# EAGLE design FidoBark11 (EAGLE 7.2.0)
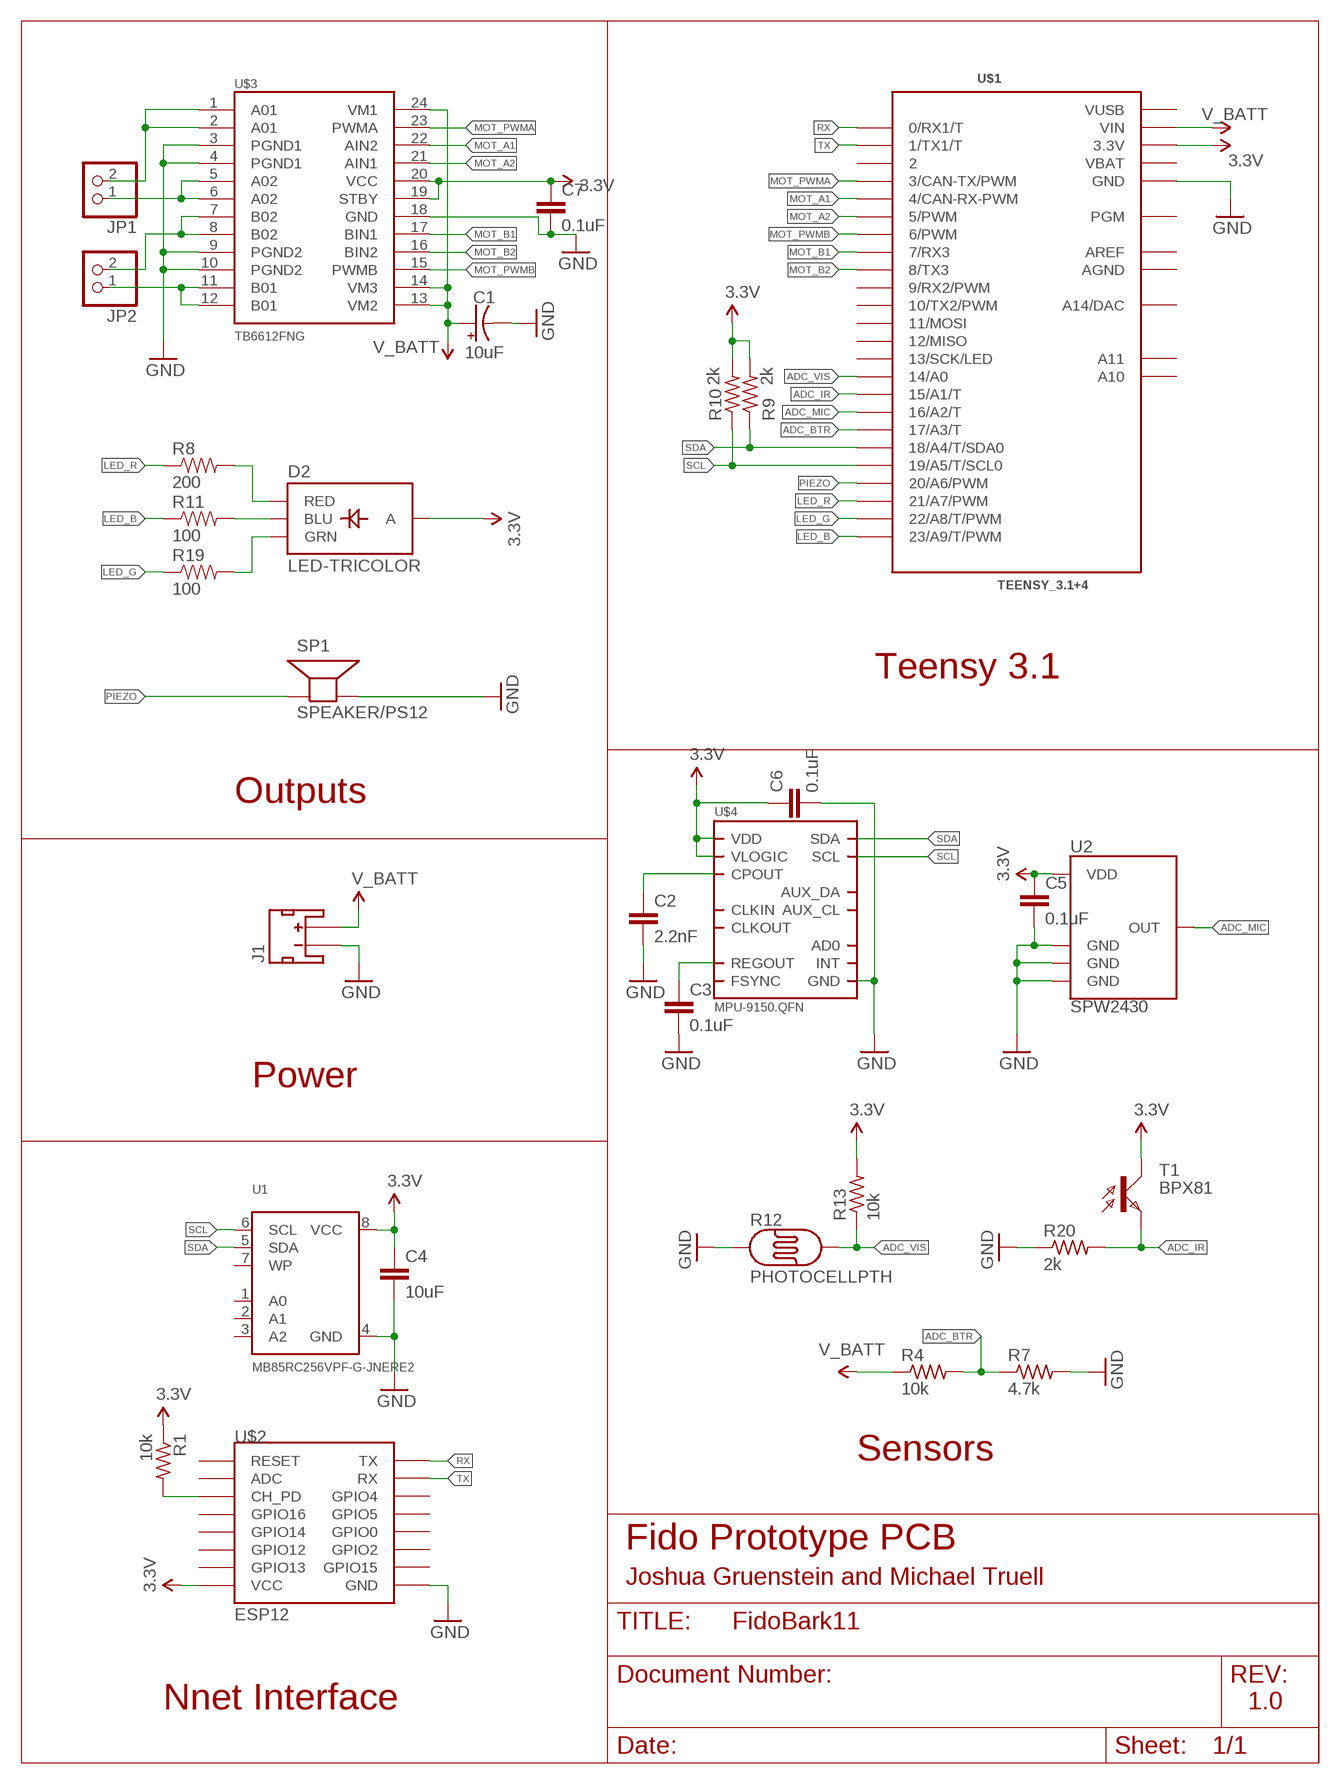
[diagram p0: schematic, sheet 1]

## Parts
C1  10uF  CAP_POL1206  [EIA3216]
C2  2.2nF  C-EUC0603  [C0603]
C3  0.1uF  C-EUC0603  [C0603]
C4  10uF  CAP0603-CAP  [0603-CAP]
C5  0.1uF  C-EUC0603  [C0603]
C6  0.1uF  C-EUC0603  [C0603]
C7  0.1uF  C-EUC0603  [C0603]
D2  LED-TRICOLOR  [LED-TRICOLOR-SMD]
J1  JST_2MM_MALE  [JST-2-SMD]
JP1  PINHD-1X2  [1X02]
JP2  PINHD-1X2  [1X02]
R1  10k  R-US_R0603  [R0603]
R4  10k  R-US_R0603  [R0603]
R7  4.7k  R-US_R0603  [R0603]
R8  200  RESISTOR0402-RES  [0402-RES]
R9  2k  R-US_R0603  [R0603]
R10  2k  R-US_R0603  [R0603]
R11  100  RESISTOR0402-RES  [0402-RES]
R12  PHOTOCELLPTH  [PHOTOCELL]
R13  10k  R-US_R0603  [R0603]
R19  100  RESISTOR0402-RES  [0402-RES]
R20  2k  R-US_R0603  [R0603]
SP1  SPEAKER/PS12  [PS12]
T1  BPX81  [BPX81]
U1  MB85RC256VPF-G-JNERE2  FRAM_SOIC8_I2C  [SOIC8_208MIL]
U2  SPW2430  ADMP401  [ADMP401]
U$1  TEENSY_3.1+4  [TEENSY_3.1+4]
U$2  ESP12  [ESP12]
U$3  TB6612FNG  [SSOP24]
U$4  MPU-9150.QFN  [QFN.24.4X4]

## Nets
3.3V: C4.1 C5.1 C6.1 C7.1 D2.A R1.1 R9.2 R10.2 R13.2 T1.C U1.8(VCC) U2.5(VDD) U$1.3.3V U$1.3.3V1(3.3V) U$2.VCC U$3.19(STBY) U$3.20(VCC) U$4.3(VDD) U$4.8(VLOGIC) U$4.13(VDD)
ADC_BTR: R4.2 R7.1 U$1.17/A3(17/A3/T)
ADC_IR: R20.2 T1.E U$1.15/A1(15/A1/T)
ADC_MIC: U2.1(OUT) U$1.16/A2(16/A2/T)
ADC_VIS: R12.2 R13.1 U$1.14/A0
BLU: D2.B(BLU) R11.2
GND: C1.C(-) C2.2 C3.2 C4.2 C5.2 C6.2 C7.2 J1.1(-) R7.2 R12.1 R20.1 SP1.P$2(-) U1.4(GND) U2.2(GND) U2.4(GND) U2.6(GND) U$1.GND U$1.GND1(GND) U$2.GND U$3.3(PGND1) U$3.4(PGND1) U$3.9(PGND2) U$3.10(PGND2) U$3.18(GND) U$4.15(GND) U$4.17(GND) U$4.18(GND)
GRN: D2.G(GRN) R19.2
LED_B: R11.1 U$1.23/A9(23/A9/T/PWM)
LED_G: R19.1 U$1.22/A8(22/A8/T/PWM)
LED_R: R8.1 U$1.21/A7(21/A7/PWM)
MOT_A1: U$1.4(4/CAN-RX-PWM) U$3.22(AIN2)
MOT_A2: U$1.5(5/PWM) U$3.21(AIN1)
MOT_B1: U$1.7(7/RX3) U$3.17(BIN1)
MOT_B2: U$1.8(8/TX3) U$3.16(BIN2)
MOT_PWMA: U$1.3(3/CAN-TX/PWM) U$3.23(PWMA)
MOT_PWMB: U$1.6(6/PWM) U$3.15(PWMB)
N$1: JP1.2 U$3.1(A01) U$3.2(A01)
N$2: R1.2 U$2.CH_PD
N$3: JP1.1 U$3.5(A02) U$3.6(A02)
N$4: JP2.2 U$3.7(B02) U$3.8(B02)
N$5: JP2.1 U$3.11(B01) U$3.12(B01)
N$8: C3.1 U$4.10(REGOUT)
N$9: C2.1 U$4.20(CPOUT)
PIEZO: SP1.P$1(+) U$1.20/A6(20/A6/PWM)
RED: D2.R(RED) R8.2
RX: U$1.0(0/RX1/T) U$2.TX
SCL: R10.1 U1.6(SCL) U$1.19/A5(19/A5/T/SCL0) U$4.23(SCL)
SDA: R9.1 U1.5(SDA) U$1.18/A4(18/A4/T/SDA0) U$4.24(SDA)
TX: U$1.1(1/TX1/T) U$2.RX
V_BATT: C1.A(+) J1.2(+) R4.1 U$1.VIN U$3.13(VM2) U$3.14(VM3) U$3.24(VM1)
Unconnected: J1.NC1(PAD1) J1.NC2(PAD2) U1.1(A0) U1.2(A1) U1.3(A2) U1.7(WP) U$1.2 U$1.9(9/RX2/PWM) U$1.10(10/TX2/PWM) U$1.11(11/MOSI) U$1.12(12/MISO) U$1.13(13/SCK/LED) U$1.A10 U$1.A11 U$1.A14(A14/DAC) U$1.PGM U$2.ADC U$2.GPIO0 U$2.GPIO2 U$2.GPIO4 U$2.GPIO5 U$2.GPIO12 U$2.GPIO13 U$2.GPIO14 U$2.GPIO15 U$2.GPIO16 U$2.RESET U$4.1(CLKIN) U$4.6(AUX_DA) U$4.7(AUX_CL) U$4.9(AD0) U$4.11(FSYNC) U$4.12(INT) U$4.22(CLKOUT)

## Notes on the sheet
- Teensy 3.1
- Outputs
- Power
- Sensors
- Fido Prototype PCB
- Joshua Gruenstein and Michael Truell
- Nnet Interface | 1.0

## Power pins joined to a net without a drawn wire
AGND: U$1.AGND
AREF: U$1.AREF
VBAT: U$1.VBAT
VUSB: U$1.VUSB

## Library data of the parts
C1 = SparkFun-Capacitors:CAP_POL: Capacitor Polarized These are standard SMD and PTH capacitors. Normally 10uF, 47uF, and 100uF in electrolytic and tantalum varieties. Always verify the external diameter of the through hole cap, it varies with capacity, voltage, and manufacturer. The EIA devices should be standard.
C2 C3 = rcl:C-EU: CAPACITOR, European symbol
C4 = SparkFun-Passives:CAP: Capacitor Standard 0603 ceramic capacitor, and 0.1" leaded capacitor.
C5-C7 = resistor:C-EU: CAPACITOR, European symbol
D2 = SparkFun:LED-TRICOLOR: Tri-Color LED SMD Proven layout and schematic for triple color LED in SMD package - common anode. Spark Fun Electronics SKU : COM-07844
J1 = SparkFun-Connectors:JST_2MM_MALE: Mates to single-cell LiPo batteries. CONN-11443 Now with smashable polarity marks!; BTM_NEG: -; BTM_POS: +; PROD_ID: CONN-11443; TOP_NEG: -; TOP_POS: +
JP1 JP2 = pinhead:PINHD-1X2: PIN HEADER
R1 R4 R7 R9 R10 = rcl:R-US_: RESISTOR, American symbol
R8 R11 R19 = SparkFun:RESISTOR: Resistor Basic schematic elements and footprints for 0603, 1206, and PTH resistors.
R12 = SparkFun-Sensors:PHOTOCELL: CdS photoresistor. This is a low cost way to detect light levels. Resistance decreases with more incoming light. SparkFun SKU: SEN-09088
R13 R20 = adafruit:R-US_: RESISTOR, American symbol
SP1 = adafruit:SPEAKER: SPEAKER Source: Buerklin Added PS12 (for part # PS1240 piezo) http://www.ladyada.net/library/pcb/eaglelibrary.html
T1 = opto-trans-siemens:BPX81: PHOTO TRANSISTOR; OC_FARNELL: unknown; OC_NEWARK: unknown
U1 = microbuilder:FRAM_SOIC8_I2C: I2C FRAM - SOIC8 Package 256KBit (32Kx8) - MB85RC256VPF-G-JNERE2 - SOIC-8 200 Mil, 2.7-5.5V, -40°C-85°C
U2 = SparkFun:ADMP401
U$1 = Teensy_3_Series_Board_v1.0:TEENSY_3.1+4: Footprint for Teensy 3.1 board using all through-holes, i.e. the entire perimeter plus the 4 through-holes inboard (A10,A11,AREF, VUSB)
U$2 = esp8266modules:ESP12: ESP8266 Wifi module 12
U$3 = SparkFun-PowerIC:TB6612FNG: Toshiba 1A dual motor driver IC-09363; PROD_ID: IC-09363
U$4 = invensense:MPU-9150

## Board
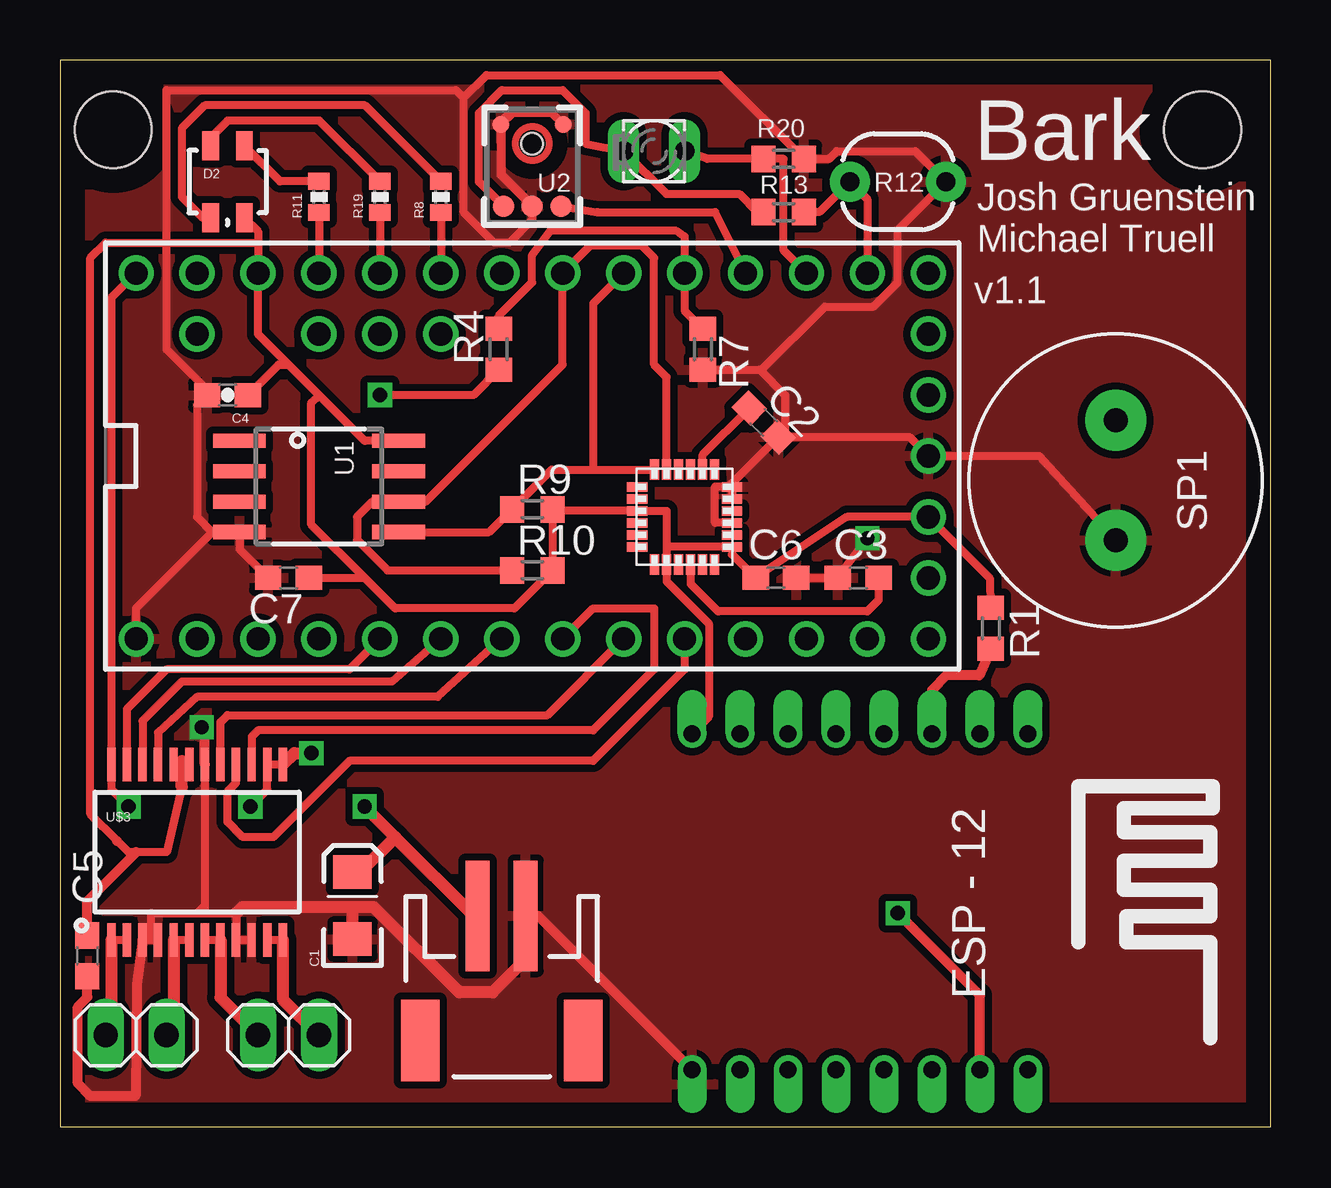
[diagram p1: board, top side]
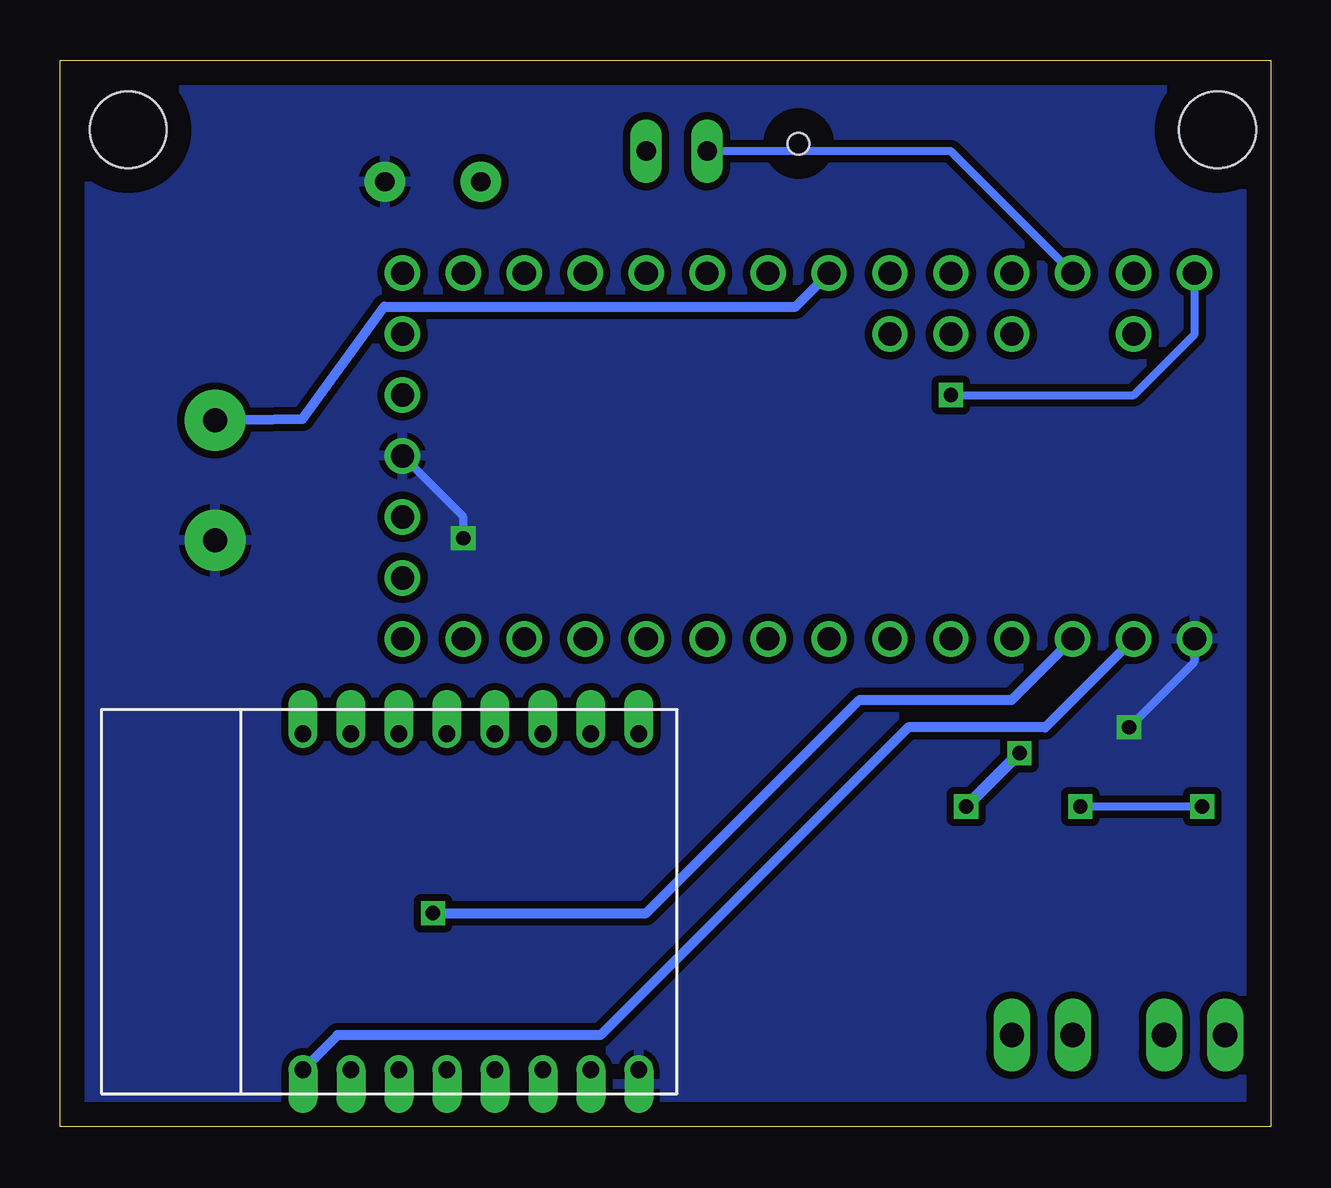
[diagram p2: board, bottom side, seen from below]

Size 50.47 x 44.44 mm. Coordinates in mm from the lower left corner, seen from the top.
Outline: 0,0 50.47,0 50.47,44.44 0,44.44 0,0
Copper layers (1*16): Top 0.035mm / dielectric 1.5mm / Bottom 0.035mm
Design rules "default": minimum track width 10mil, minimum drill 24mil, track to track 8mil, track to pad 8mil, pad to pad 8mil, via to via 8mil, smd to smd 8mil, copper to edge 40mil, drill to drill 8mil, minimum pad ring 10mil, minimum via ring 8mil, stop-mask expansion 4mil, vias tented up to drill 0mil, thermal gap 10mil
Holes 3.2 mm at 2.22,41.53 47.62,41.53

### Footprints (pad centres in the part's own frame; a part is rotated, then mirrored left to right if it is on the bottom)
EIA3216 = smd 1.4 x 1.6: A 1.4,0; C -1.4,0
C0603 = smd 1.1 x 1: 1 -0.85,0; 2 0.85,0
0603-CAP = smd 1.1 x 1: 1 -0.85,0; 2 0.85,0
LED-TRICOLOR-SMD = smd 0.7 x 1.2: A 0.7,-1.5; B 0.7,1.5; G -0.7,1.5; R -0.7,-1.5
JST-2-SMD = smd 1 x 4.6: 1 -1,-3.7; 2 1,-3.7 | smd 1.6 x 3.4: NC1 -3.4,1.5; NC2 3.4,1.5
1X02 = drill 1.016 long: 1 -1.27,0; 2 1.27,0
R0603 = smd 1 x 1.1: 1 -0.85,0; 2 0.85,0
0402-RES = smd 0.7 x 0.9: 1 -0.65,0; 2 0.65,0
PHOTOCELL = drill 0.8 pad 1.676: 1 -2,0; 2 2,0
PS12 = drill 1 pad 2.54: P$1 -2.5,0; P$2 2.5,0
BPX81 = drill 0.813 long: C 1.27,0; E -1.27,0
SOIC8_208MIL = smd 0.6 x 2.2: 1 -1.905,-3.315; 2 -0.635,-3.315; 3 0.635,-3.315; 4 1.905,-3.315; 5 1.905,3.315; 6 0.635,3.315; 7 -0.635,3.315; 8 -1.905,3.315
ADMP401 = smd 0.9 x 0.9: 1 -1.2,2.62; 5 1.2,2.62; 6 0,2.62 | smd 0.7 x 0.7: 2 1.3,-0.8; 4 -1.3,-0.8 | hole 0.9: 0,0
TEENSY_3.1+4 = drill 0.965: 0 -7.62,15.24; 1 -7.62,12.7; 2 -7.62,10.16; 3 -7.62,7.62; 3.3V 7.62,12.7; 3.3V1 -2.54,-15.24; 4 -7.62,5.08; 5 -7.62,2.54; 6 -7.62,0; 7 -7.62,-2.54; 8 -7.62,-5.08; 9 -7.62,-7.62; 10 -7.62,-10.16; 11 -7.62,-12.7; 12 -7.62,-15.24; 13 7.62,-15.24; 14/A0 7.62,-12.7; 15/A1 7.62,-10.16; 16/A2 7.62,-7.62; 17/A3 7.62,-5.08; 18/A4 7.62,-2.54; 19/A5 7.62,0; 20/A6 7.62,2.54; 21/A7 7.62,5.08; 22/A8 7.62,7.62; 23/A9 7.62,10.16; A10 5.08,7.62; A11 5.08,5.08; A14 5.08,-15.24; AGND 7.62,15.24; AREF 5.08,10.16; GND -7.62,17.78; GND1 0,-15.24; PGM 2.54,-15.24; VBAT -5.08,-15.24; VIN 7.62,17.78; VUSB 5.08,15.24
ESP12 = drill 0.7 offset: ADC -7.1,3.8; CH_PD -7.1,1.8; GND 6.9,-8.2; GPIO0 6.9,-2.2; GPIO2 6.9,-4.2; GPIO4 6.9,1.8; GPIO5 6.9,-0.2; GPIO12 -7.1,-4.2; GPIO13 -7.1,-6.2; GPIO14 -7.1,-2.2; GPIO15 6.9,-6.2; GPIO16 -7.1,-0.2; RESET -7.1,5.8; RX 6.9,3.8; TX 6.9,5.8; VCC -7.1,-8.2
SSOP24 = smd 0.348 x 1.397: 1 -3.575,-3.656; 2 -2.925,-3.656; 3 -2.275,-3.656; 4 -1.625,-3.656; 5 -0.975,-3.656; 6 -0.325,-3.656; 7 0.325,-3.656; 8 0.975,-3.656; 9 1.625,-3.656; 10 2.275,-3.656; 11 2.925,-3.656; 12 3.575,-3.656; 13 3.575,3.656; 14 2.925,3.656; 15 2.275,3.656; 16 1.625,3.656; 17 0.975,3.656; 18 0.325,3.656; 19 -0.325,3.656; 20 -0.975,3.656; 21 -1.625,3.656; 22 -2.275,3.656; 23 -2.925,3.656; 24 -3.575,3.656
QFN.24.4X4 = smd 0.85 x 0.38: 1 -1.975,1.25; 2 -1.975,0.75; 3 -1.975,0.25; 4 -1.975,-0.25; 5 -1.975,-0.75; 6 -1.975,-1.25; 13 1.975,-1.25; 14 1.975,-0.75; 15 1.975,-0.25; 16 1.975,0.25; 17 1.975,0.75; 18 1.975,1.25 | smd 0.38 x 0.85: 7 -1.25,-1.975; 8 -0.75,-1.975; 9 -0.25,-1.975; 10 0.25,-1.975; 11 0.75,-1.975; 12 1.25,-1.975; 19 1.25,1.975; 20 0.75,1.975; 21 0.25,1.975; 22 -0.25,1.975; 23 -0.75,1.975; 24 -1.25,1.975

### Placement (x,y rotation side)
C1  12.19,9.21 90 top
C2  29.34,29.34 315 top
C3  33.27,22.86 180 top
C4  6.99,30.48 180 top
C5  1.14,7.11 270 top
C6  29.84,22.86 0 top
C7  9.53,22.86 180 top
D2  6.99,39.37 0 top
J1  18.41,5.08 180 top
JP1  3.17,3.81 180 top
JP2  9.53,3.81 180 top
R1  38.8,20.76 270 top
R4  18.29,32.38 90 top
R7  26.8,32.38 270 top
R8  15.88,38.73 90 top
R9  19.68,25.72 0 top
R10  19.68,23.18 0 top
R11  10.79,38.73 90 top
R12  34.92,39.37 180 top
R13  30.16,38.1 180 top
R19  13.34,38.73 90 top
R20  30.16,40.32 180 top
SP1  44.01,26.92 270 top
T1  24.77,40.64 180 top
U1  10.79,26.67 270 top
U2  19.68,40.96 180 top
U$1  20.95,27.94 90 top
U$2  34.54,9.27 270 top
U$3  5.71,11.43 0 top
U$4  26.04,25.4 0 top

### Tracks (layer width: path | path; a pad name or v marks a point on that pad's centre or on a via)
3.3V
  Top 0.305: U$3.20 U$3.19
  Top 0.33: D2.A 8.26,37.3 8.26,36.83 | 5.08,14.14 4.45,11.43 3.17,11.43 2.86,11.43 2.38,11.91 1.27,13.02 1.27,36.2 1.91,36.83 8.26,36.83 | U2.5 17.46,39.36 17.46,42.23 18.41,43.18 20.95,43.18 21.91,42.23 21.91,40.96 T1.C 25.27,38.86 28.32,38.86 29.08,38.1 R13.2 | U1.8 12.7,28.57 10.79,30.48 | 10.79,30.48 9.53,31.75 | 9.53,31.75 8.26,33.02 U$1.3.3V 8.26,36.83 | C4.1 9.11,31.75 9.53,31.75 | 12.7,22.86 13.97,21.59 18.95,21.59 R10.2 R9.2 20.6,25.65 U$4.3 25.29,25.65 25.29,24.13 | 12.7,22.86 10.48,25.08 10.48,30.16 10.79,30.48 | 25.29,24.13 U$4.8 25.29,22.72 27.05,20.95 27.05,17.08 U$2.VCC | 25.29,24.13 25.3,24.15 U$4.13 28.01,23.84 C6.1 32.8,25.4 U$1.3.3V1 38.77,22.82 R1.1 | C7.1 12.7,22.86 | 5.08,15.24 U$3.19
  Top 0.406: 2.37,11.9 2.38,11.91 | C5.1 1.14,9.4 3.17,11.43
  Top 0.508: 5.08,14.14 5.08,15.24
  Bottom 0.33: U$1.3.3V 13.34,40.64 T1.C
ADC_BTR
  Top 0.33: R7.1 26.04,34 U$1.17/A3 26.04,37.08 25.65,37.34 20.45,37.34 19.68,36.32 19.68,35.18 18.29,33.78 R4.2
ADC_IR
  Top 0.33: T1.E 26.99,40.32 R20.2 30.16,40.32 30.16,36.51 U$1.15/A1
ADC_MIC
  Top 0.33: U2.1 22.39,38.1 27.3,38.1 U$1.16/A2
ADC_VIS
  Top 0.33: U$1.14/A0 33.66,38.64 R12.2 31.66,38.1 R13.1
BLU
  Top 0.33: R11.2 9.17,39.38 D2.B
GND  (via drill 0.6)
  Top 0.33: U$3.3 U$3.4 3.81,7.77 3.81,8.89 5.71,8.89 | 5.71,8.89 6.03,8.89 | 6.03,8.89 7.34,8.89 U$3.9 U$3.10 | U$3.18 6.03,8.89 | U2.6 18.39,39.64 U2.2 18.86,42.23 | U2.4 20.52,42.23 18.86,42.23 | 18.86,42.23 18.73,42.23 18.41,41.91 18.41,39.69 19.68,38.42 19.68,37.78 18.73,36.83 18.1,36.83 16.83,38.1 16.83,42.86 | 16.83,42.86 17.78,43.81 27.52,43.81 R20.1 32.07,40.32 32.38,40.64 35.66,40.64 R12.1 34.92,37.37 34.92,35.18 33.91,34.16 31.88,34.16 29.25,31.54 29.17,31.54 | 6.35,24.77 5.71,25.4 5.71,30.06 C4.2 6.13,30.7 4.45,32.38 4.45,43.18 16.51,43.18 16.83,42.86 | 6.35,24.77 U1.4 7.48,24.05 C7.2 | U$4.18 U$4.17 | U$4.18 28.01,26.81 C2.2 | C2.2 35.4,28.74 U$1.GND1 40.81,27.94 SP1.P$2 | R7.2 29.17,31.54 | 29.17,31.54 30.23,30.48 30.23,29.02 C2.2 | 32.38,22.86 C3.2 | C6.2 32.38,22.86 | 32.38,22.86 v33.66,24.51 | U$4.15 27.3,25.15 27.3,26.67 28.01,26.67 U$4.18 | U$1.GND 3.17,21.59 6.35,24.77 | U$3.18 6.03,9.21 5.71,8.89
  Top 0.406: U$2.GND 19.93,8.78 J1.1 | U$3.18 6.03,16.51 v5.91,16.64 | U$3.3 3.2,5.93 3.15,1.29 3.13,1.27 1.27,1.27 0.74,1.8 0.74,4.99 1.14,5.39 C5.2
  Top 0.508: J1.1 19.41,6.97 18.03,5.59 16.64,5.59 13.08,9.14 12.06,9.14 | 7.34,8.89 7.59,9.14 12.06,9.14 | C1.C 12.19,9.02 12.06,9.14
  Bottom 0.33: v5.91,16.64 3.17,19.37 U$1.GND | v33.66,24.51 33.66,25.4 U$1.GND1
  pour Bottom (isolate 0.305): -1.27,-1.27 52.07,-1.27 52.07,45.72 -1.27,45.72
  pour Top (isolate 0.305): -1.27,45.72 52.07,45.72 52.07,-1.27 -1.27,-1.27
GRN
  Top 0.33: R19.2 10.81,41.91 6.99,41.91 6.29,41.21 D2.G
LED_B
  Top 0.33: R11.1 U$1.23/A9
LED_G
  Top 0.33: R19.1 U$1.22/A8
LED_R
  Top 0.33: R8.1 U$1.21/A7
MOT_A1
  Top 0.33: U$1.4 13.84,18.54 5.08,18.54 3.44,16.9 U$3.22
MOT_A2
  Top 0.33: U$1.5 15.75,17.91 5.71,17.91 4.09,16.41 U$3.21
MOT_B1
  Top 0.33: U$3.17 6.69,16.85 6.99,17.14 20.32,17.14 U$1.7
MOT_B2
  Top 0.33: U$1.8 26.04,19.05 22.23,15.24 12.06,15.24 8.89,12.06 7.62,12.06 6.99,12.7 6.99,13.97 7.34,14.32 U$3.16
MOT_PWMA
  Top 0.33: U$1.3 12.06,19.05 4.45,19.05 2.79,17.39 U$3.23
MOT_PWMB
  Top 0.33: U$1.6 22.23,21.59 24.77,21.59 24.77,19.05 22.23,16.51 8.26,16.51 7.99,16.25 U$3.15
N$1
  Top 0.33: JP1.2 2.14,3.81 | U$3.1 U$3.2
  Top 0.508: U$3.1 2.14,4.04 JP1.2
N$2
  Top 0.406: R1.2 38.31,18.8 36.96,18.8 36.34,18.18 U$2.CH_PD
N$3
  Top 0.33: U$3.5 U$3.6
  Top 0.508: U$3.5 4.74,4.11 JP1.1
N$4
  Top 0.33: U$3.7 U$3.8
  Top 0.508: U$3.8 6.69,5.38 JP2.2
N$5
  Top 0.33: U$3.11 U$3.12
  Top 0.508: U$3.12 9.29,5.32 JP2.1
N$8
  Top 0.33: U$4.10 26.29,22.61 27.43,21.46 33.66,21.46 34.12,21.93 C3.1
N$9
  Top 0.33: U$4.20 26.79,27.99 C2.1
PIEZO
  Bottom 0.406: SP1.P$1 40.36,29.49 36.96,34.16 19.81,34.16 U$1.20/A6
RED
  Top 0.33: R8.2 12.71,42.55 6.03,42.55 5.08,41.59 5.08,38.73 5.95,37.87 D2.R
RX
  Bottom 0.406: U$1.0 9.4,16.64 15.11,16.64 27.94,3.81 38.91,3.81 U$2.TX
SCL
  Top 0.33: R10.1 13.65,23.18 12.38,24.45 12.38,25.4 13.02,26.04 U1.6 15.24,26.04 20.95,31.75 U$1.19/A5 22.1,36.7 24.26,36.7 24.77,36.2 24.77,31.75 25.29,31.23 U$4.23
SDA
  Top 0.33: 22.23,27.38 20.49,27.38 R9.1 17.88,24.77 U1.5 | 22.23,27.38 U$4.24 | U$1.18/A4 22.23,34.29 22.23,27.38
TX  (via drill 0.6)
  Top 0.406: U$2.RX 38.34,5.47 v34.92,8.89
  Bottom 0.406: v34.92,8.89 26.04,8.89 17.14,17.78 10.79,17.78 U$1.1
V_BATT  (via drill 0.6)
  Top 0.33: U$3.13 U$3.14 8.64,14.04 v7.94,13.34 | v2.86,13.34 2.14,14.05 U$3.24 2.14,34.52 U$1.VIN | R4.1 17.23,30.48 v13.34,30.48
  Top 0.508: U$3.13 9.76,15.56 v10.48,15.56 | v12.7,13.34 13.97,12.06 | 13.97,12.06 17.25,8.78 J1.2 | C1.A 12.51,10.61 13.97,12.06
  Bottom 0.33: v2.86,13.34 v7.94,13.34 | v13.34,30.48 5.71,30.48 3.17,33.02 U$1.VIN
  Bottom 0.508: v10.48,15.56 v12.7,13.34

### Text on the board
tNames: Bark | Josh Gruenstein / Michael Truell | v1.1